# Altium schematic sheet 5V2A Flyback converter Schematic.SchDoc
size A; SheetNumber: 1; SheetTotal: 1; SPICEModelCachePZIJJSTJ: <root> / <DocumentId>PZIJJSTJ</DocumentId> / <CacheFrame Number="0"> / <Model Name="0805_885382207001_1uf" Kind="CKT"> / <Text>******* / .subckt 0805_885382207001_1uF 1 2 / Rser 1 3 0.0237265668732 / Lser 2 4 8.71815019E-10 / C1 3 4 0.000001 / Rpar 3 4 500000000 / .ends 0805_885382207001_1uF</Text> / </Model> / <Model Name="0805_885382207007_100nf" Kind="CKT"> / <Text>******* / .subckt 0805_885382207007_100nF 1 2 / Rser 1 3 0.0397714465846 / Lser 2 4 9.11116414E-10 / C1 3 4 0.0000001 / Rpar 3 4 5000000000 / .ends 0805_885382207007_100nF</Text> / </Model> / <Model Name="1206_885382208006_100nf" Kind="CKT"> / <Text>******* / .subckt 1206_885382208006_100nF 1 2 / Rser 1 3 0.0371158193445 / Lser 2 4 1.097090305E-12 / C1 3 4 0.0000001 / Rpar 3 4 1000000000 / .ends 1206_885382208006_100nF</Text> / </Model> / <Model Name="1206_885382208002_10nf" Kind="CKT"> / <Text>******* / .subckt 1206_885382208002_10nF 1 2 / Rser 1 3 0.131552570055 / Lser 2 4 1.072395374E-09 / C1 3 4 0.00000001 / Rpar 3 4 10000000000 / .ends 1206_885382208002_10nF</Text> / </Model> / <Model Name="0805_885342207005_10nf" Kind="CKT"> / <Text>******* / .subckt 0805_885342207005_10nF 1 2 / Rser 1 3 0.0585018213517 / Lser 2 4 3.64385526E-10 / C1 3 4 0.00000001 / Rpar 3 4 10000000000 / .ends 0805_885342207005_10nF</Text> / </Model> / <Model Name="1812_885342211006_100nf" Kind="CKT"> / <Text>******* / .subckt 1812_885342211006_100nF 1 2 / Rser 1 3 0.0138355219015 / Lser 2 4 8.12989182E-10 / C1 3 4 0.0000001 / Rpar 3 4 1000000000 / .ends 1812_885342211006_100nF</Text> / </Model> / </CacheFrame> / </root>
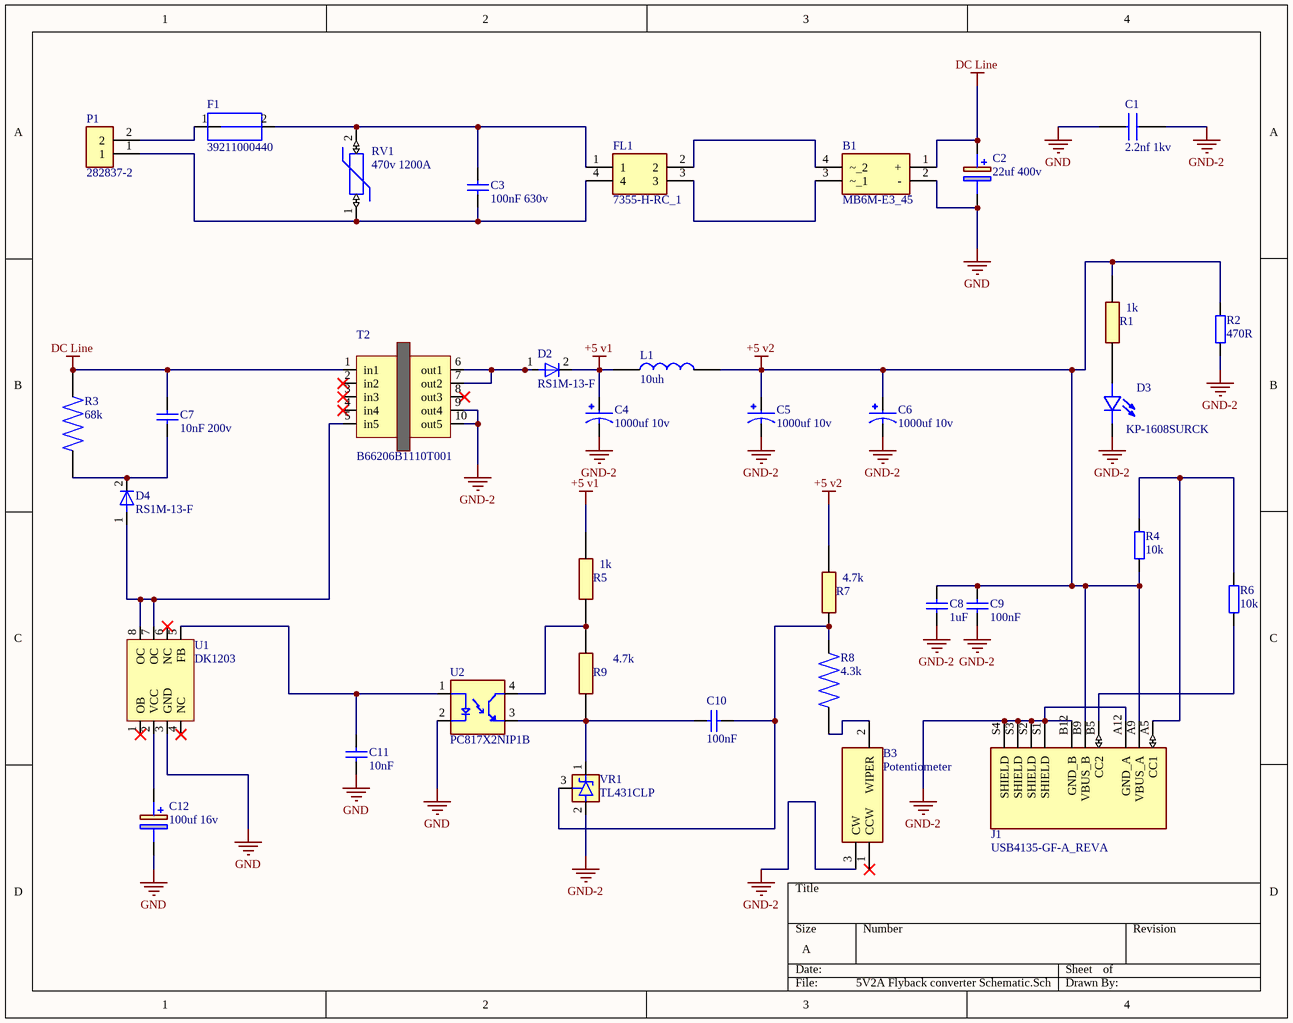
[diagram p0: 5V2A Flyback converter Schematic.SchDoc]

## Parts
B1  MB6M-E3_45  [DIP508W74P254L469H270Q4N]
B3  Potentiometer  [3296Y1504LF]
C1  2.2nf 1kv  [CK45B3AD222KYNNA]
C2  22uf 400v  [CAPPRD500W65D1250H2700]
C3  100nF 630v  [WCAP-CSMH_1812_L4.5W3.2H2]
C4  1000uf 10v  [CAP_EEEFN1A102P]
C5  1000uf 10v  [CAP_EEEFN1A102P]
C6  1000uf 10v  [CAP_EEEFN1A102P]
C7  10nF 200v  [WCAP-CSMH_0805_L2W1.25H1.25]
C8  1uF  [WCAP-CSST_0805_L2W1.25H1.25]
C9  100nF  [WCAP-CSST_0805_L2W1.25H1.25]
C10  100nF  [WCAP-CSST_1206_L3.2W1.6H1.25]
C11  10nF  [WCAP-CSST_1206_L3.2W1.6H1.25]
C12  100uf 16v  [CAPAE1030X1100N]
D2  RS1M-13-F  [B360A-13-F]
D3  KP-1608SURCK  [LED_KP-1608SURCK]
D4  RS1M-13-F  [B360A-13-F]
F1  39211000440  [Littelfuse 39211000440]
FL1  7355-H-RC_1  [7355HRC]
J1  USB4135-GF-A_REVA  [GCT_USB4135-GF-A_REVA]
L1  10uh  [INDPM5552X200N]
P1  282837-2  [TE_282837-2]
R1  1k  [4.7k]
R2  470R  [RES_0402]
R3  68k  [RES_ERA6ARW683V]
R4  10k  [RES_0402]
R5  1k  [4.7k]
R6  10k  [RES_0402]
R7  4.7k  [4.7k]
R8  4.3k  [RES_ERJU03F4301V]
R9  4.7k  [4.7k]
RV1  470v 1200A  [MOV-07DXXXK(3.9T)]
T2  B66206B1110T001  [PCBComponent_1 - duplicate]
U1  DK1203  [DK1203 - duplicate]
U2  PC817X2NIP1B  [SOIC254P960X420-4N]
VR1  TL431CLP  [VREG_TL431CLP]

## Nets
+5 v1: C4.1 D2.2 L1.1 R5.2
+5 v2: C5.1 C6.1 C8.2 C9.2 J1.A9(VBUS_A) J1.B9(VBUS_B) L1.2 R1.2 R2.2 R4.1 R7.2
DC Line: B1.1(+) C2.1(+) C7.2 R3.2 T2.1(in1)
GND: B1.2(-) C1.1 C2.2(-) C11.1 C12.2(-) U1.3(GND) U2.2(C)
GND-2: B3.3(CW) C1.2 C4.2 C5.2 C6.2 C8.1 C9.1 D3.2(C) J1.A12(GND_A) J1.B12(GND_B) J1.S1(SHIELD) J1.S2(SHIELD) J1.S3(SHIELD) J1.S4(SHIELD) R2.1 T2.9(out4) T2.10(out5) VR1.2(ANODE)
NetB1_3: B1.3(~_1) FL1.3
NetB1_4: B1.4(~_2) FL1.2
NetB3_2: B3.2(WIPER) R8.1
NetC3_1: C3.1 FL1.4 P1.1 RV1.1
NetC3_2: C3.2 F1.2 FL1.1 RV1.2
NetC7_1: C7.1 D4.2 R3.1
NetC10_1: C10.1 R9.1 U2.3(ET) VR1.1(CATHODE)
NetC10_2: C10.2 R7.1 R8.2 VR1.3(REF)
NetC11_2: C11.2 U1.5(FB) U2.1(A)
NetC12_1: C12.1(+) U1.2(VCC)
NetD2_1: D2.1 T2.6(out1) T2.7(out2)
NetD3_1: D3.1(A) R1.1
NetD4_1: D4.1 T2.5(in5) U1.7(OC) U1.8(OC)
NetF1_1: F1.1 P1.2
NetJ1_A5: J1.A5(CC1) R4.2 R6.2
NetJ1_B5: J1.B5(CC2) R6.1
NetR5_1: R5.1 R9.2 U2.4(CT)

Not connected (* = marked no-connect by the designer): B3 1(CCW)*; T2 2(in2)* 3(in3)* 4(in4)* 8(out3)*; U1 1(OB)* 4(NC)* 6(NC)*

## Library data of the parts
B1 = MB6M-E3_45: Diode Rectifier Bridge Single 600V 0.8A Vishay MB6M-E3/45, Bridge Rectifier, 0.8A 600V, 4-Pin MBM; Geometry.Height: 2.7mm; Manufacturer_Name: Vishay; Manufacturer_Part_Number: MB6M-E3/45; Mouser Part Number: 625-MB6M-E3; Mouser Price/Stock: https://www.mouser.co.uk/ProductDetail/Vishay-General-Semiconductor/MB6M-E3-45?qs=NyKJzQ80QAzaNJrfLfHWPg%3D%3D; Arrow Part Number: MB6M-E3/45; Arrow Price/Stock: https://www.arrow.com/en/products/mb6m-e345/vishay?region=nac; Datasheet Link: http://www.vishay.com/docs/88660/mb2m.pdf
B3 = Potentiometer: Trimmer Resistors - Through Hole 3/8" 500Kohms Sealed Vertical Adjust; Manufacturer_Name: Bourns; Manufacturer_Part_Number: 3296Y-1-504LF; Geometry.Height: 10.28mm; Mouser Part Number: 652-3296Y-1-504LF; Mouser Price/Stock: https://www.mouser.co.uk/ProductDetail/Bourns/3296Y-1-504LF?qs=YcQ0SKcgwSr8aRG8Of3gNA%3D%3D; Arrow Part Number: 3296Y-1-504LF; Arrow Price/Stock: https://www.arrow.com/en/products/3296y-1-504lf/bourns?region=nac; Datasheet Link: https://componentsearchengine.com/Datasheets/2/3296Y-1-504LF.pdf
C1 = 2.2nf 1kv: Disc Type Capacitors with Lead (High Voltage Ceramic Capacitors), Capacitance=2.2nF, DxT: 8.5x5mm ,F: 5mm; Manufacturer_Name: TDK; Manufacturer_Part_Number: CK45-B3AD222KYNNA; Geometry.Height: 12.5mm; Mouser Part Number: 810-CK45-B3AD222NNA; Mouser Price/Stock: https://www.mouser.co.uk/ProductDetail/TDK/CK45-B3AD222KYNNA?qs=2FIyTMJ0hNk3eTUvPTIP4A%3D%3D; Arrow Part Number: CK45-B3AD222KYNNA; Arrow Price/Stock: https://www.arrow.com/en/products/ck45-b3ad222kynna/tdk?utm_currency=USD&region=nac; Datasheet Link: https://product.tdk.com/system/files/dam/doc/product/capacitor/ceramic/lead-disc/catalog/leaddisc_commercial_ck45_en.pdf
C2 = 22uf: Aluminium Electrolytic Capacitors - Radial Leaded Al Lytic Cap Radial NHG Series 105C; Manufacturer_Name: Panasonic; Manufacturer_Part_Number: ECA-2GHG220; Geometry.Height: 27mm; Mouser Part Number: 667-ECA-2GHG220; Mouser Price/Stock: https://www.mouser.co.uk/ProductDetail/Panasonic/ECA-2GHG220?qs=ScpEy4ykWJx1iqxOLURymA%3D%3D; Arrow Part Number: ECA-2GHG220; Arrow Price/Stock: https://www.arrow.com/en/products/eca-2ghg220/panasonic; Datasheet Link: http://industrial.panasonic.com/cdbs/www-data/pdf/RDF0000/ABA0000C1215.pdf
C3 = 885342211006: WCAP-CSMH Multilayer Ceramic Chip Capacitor, Mid and High Voltage, size 1812, X7R Class II, 100nF, 630VDC; Manufacturer: Wurth Elektronik; Case/Size Code: 1812; Capacitance Tolerance: 10%; Dissipation Factor: 2.5%; Insulation Resistance: 1GΩ; Technical Reference: X7R1812104K630DFCT10000; Manufacturer Part Number: 885342211006; Category: Multilayer Ceramic Chip Capacitors; Match Code: WCAP-CSMH; ComponentLink1Description: Website Link; ComponentLink1URL: https://www.we-online.com/redexpert/article/885342211006?ad; ComponentLink2Description: Datasheet Link; ComponentLink2URL: https://www.we-online.com/redexpert/spec/885342211006?ad; Mount: Surface Mount; Operating Temperature Max: 125°C; Operating Temperature Min: -55°C; Packaging: Tape and Reel; Length: 4.5mm; Width: 3.2mm; Height: 2mm; Capacitance: 100nF; Ceramic Type: X7R Class II; Rated Voltage (DC): 630V
C4-C6 = EEEFN1A102P: CAP ALUM 1000UF 20% 10V SMD; MP: EEE-FN1A102P; MF: Panasonic Electronic Components; Package: RADIAL-2 Panasonic; Availability: In Stock; Price: None; Check_prices: https://www.snapeda.com/parts/EEE-FN1A102P/Panasonic/view-part/6178528/?ref=eda; Purchase-URL: https://pricing.snapeda.com/search/part/EEE-FN1A102P/?ref=eda; Value: *; SnapEDA_Link: https://www.snapeda.com/parts/EEE-FN1A102P/Panasonic/view-part/6178528/?ref=snap
C7 = 885342207005: WCAP-CSMH Multilayer Ceramic Chip Capacitor, Mid and High Voltage, size 0805, X7R Class II, 10nF, 200VDC; Manufacturer: Wurth Elektronik; Case/Size Code: 0805; Capacitance Tolerance: 10%; Dissipation Factor: 2.5%; Insulation Resistance: 10GΩ; Technical Reference: X7R0805103K200DFCT10000; Manufacturer Part Number: 885342207005; Category: Multilayer Ceramic Chip Capacitors; Match Code: WCAP-CSMH; ComponentLink1Description: Website Link; ComponentLink1URL: https://www.we-online.com/redexpert/article/885342207005?ad; ComponentLink2Description: Datasheet Link; ComponentLink2URL: https://www.we-online.com/redexpert/spec/885342207005?ad; Mount: Surface Mount; Operating Temperature Max: 125°C; Operating Temperature Min: -55°C; Packaging: Tape and Reel; Length: 2mm; Width: 1.25mm; Height: 1.25mm; Capacitance: 10nF; Ceramic Type: X7R Class II; Rated Voltage (DC): 200V
C8 = 885382207001: WCAP-CSST Multilayer Ceramic Chip Capacitor, Soft Termination, SMT, size 0805, X7R Class II, 1uF, 16V; Manufacturer: Wurth Elektronik; Case/Size Code: 0805; Capacitance Tolerance: +/-10%; Dissipation Factor: 5%; Insulation Resistance: 0.5GOhm; Technical Reference: X7R0805105K016DFCT1S000; Manufacturer Part Number: 885382207001; Category: Multilayer Ceramic Chip Capacitors; Match Code: WCAP-CSST; ComponentLink1Description: Website Link; ComponentLink1URL: https://www.we-online.com/redexpert/article/885382207001?ad; ComponentLink2Description: Datasheet Link; ComponentLink2URL: https://www.we-online.com/redexpert/spec/885382207001?ad; Mount: Surface Mount; Operating Temperature Max: 125°C; Operating Temperature Min: -55°C; Packaging: Tape and Reel; Length: 2mm; Width: 1.25mm; Height: 1.25mm; Capacitance: 1uF; Ceramic Type: X7R Class II; Rated Voltage (DC): 16V
C9 = 885382207007: WCAP-CSST Multilayer Ceramic Chip Capacitor, Soft Termination, SMT, size 0805, X7R Class II, 100nF, 50V; Manufacturer: Wurth Elektronik; Case/Size Code: 0805; Capacitance Tolerance: +/-10%; Dissipation Factor: 2.5%; Insulation Resistance: 5GOhm; Technical Reference: X7R0805104K050DFCT1S000; Manufacturer Part Number: 885382207007; Category: Multilayer Ceramic Chip Capacitors; Match Code: WCAP-CSST; ComponentLink1Description: Website Link; ComponentLink1URL: https://www.we-online.com/redexpert/article/885382207007?ad; ComponentLink2Description: Datasheet Link; ComponentLink2URL: https://www.we-online.com/redexpert/spec/885382207007?ad; Mount: Surface Mount; Operating Temperature Max: 125°C; Operating Temperature Min: -55°C; Packaging: Tape and Reel; Length: 2mm; Width: 1.25mm; Height: 1.25mm; Capacitance: 100nF; Ceramic Type: X7R Class II; Rated Voltage (DC): 50V
C10 = 885382208006: WCAP-CSST Multilayer Ceramic Chip Capacitor, Soft Termination, SMT, size 1206, X7R Class II, 100nF, 100V; Manufacturer: Wurth Elektronik; Case/Size Code: 1206; Capacitance Tolerance: +/-10%; Dissipation Factor: 2.5%; Insulation Resistance: 1GOhm; Technical Reference: X7R1206104K100DFCT1S000; Manufacturer Part Number: 885382208006; Category: Multilayer Ceramic Chip Capacitors; Match Code: WCAP-CSST; ComponentLink1Description: Website Link; ComponentLink1URL: https://www.we-online.com/redexpert/article/885382208006?ad; ComponentLink2Description: Datasheet Link; ComponentLink2URL: https://www.we-online.com/redexpert/spec/885382208006?ad; Mount: Surface Mount; Operating Temperature Max: 125°C; Operating Temperature Min: -55°C; Packaging: Tape and Reel; Length: 3.2mm; Width: 1.6mm; Height: 1.25mm; Capacitance: 100nF; Ceramic Type: X7R Class II; Rated Voltage (DC): 100V
C11 = 885382208002: WCAP-CSST Multilayer Ceramic Chip Capacitor, Soft Termination, SMT, size 1206, X7R Class II, 10nF, 50V; Manufacturer: Wurth Elektronik; Case/Size Code: 1206; Capacitance Tolerance: +/-10%; Dissipation Factor: 2.5%; Insulation Resistance: 10GOhm; Technical Reference: X7R1206103K050DFCT1S000; Manufacturer Part Number: 885382208002; Category: Multilayer Ceramic Chip Capacitors; Match Code: WCAP-CSST; ComponentLink1Description: Website Link; ComponentLink1URL: https://www.we-online.com/redexpert/article/885382208002?ad; ComponentLink2Description: Datasheet Link; ComponentLink2URL: https://www.we-online.com/redexpert/spec/885382208002?ad; Mount: Surface Mount; Operating Temperature Max: 125°C; Operating Temperature Min: -55°C; Packaging: Tape and Reel; Length: 3.2mm; Width: 1.6mm; Height: 1.25mm; Capacitance: 10nF; Ceramic Type: X7R Class II; Rated Voltage (DC): 50V
C12 = 100uf16v: Nichicon 100uF 16 V dc Polymer Aluminium Electrolytic Capacitor, PS Series 2000h 10 Dia. x 7.7mm; Manufacturer_Part_Number: RPS1C101MCN1GS; Geometry.Height: 11mm; Manufacturer_Name: Nichicon; Mouser Part Number: 647-RPS1C101MCN1GS; Mouser Price/Stock: https://www.mouser.co.uk/ProductDetail/Nichicon/RPS1C101MCN1GS?qs=eL6fcoQH66MLvHfa%252BDZQ0A%3D%3D; Arrow Part Number: RPS1C101MCN1GS; Arrow Price/Stock: https://www.arrow.com/en/products/rps1c101mcn1gs/nichicon?region=nac; Datasheet Link: https://www.arrow.com/en/products/rps1c101mcn1gs/nichicon?region=nac
D2 D4 = RS1M-13-F: Rectifier Diode Switching 1KV 1A 500ns 2-Pin SMA T/R / DIODE GEN PURP 1KV 1A SMA; Manufacturer: Diodes; Max Reverse Current: 5uA; Max Surge Current: 30A; Forward Voltage: 1.3V; Polarity: Standard; Value: 15pF; Supplier: Future Electronics; Supplier Part Number: 9545039; Manufacturer Part Number: RS1M-13-F; RoHS: Yes; Category: Rectifier Diodes; Stock: 400000; Pricing: 5000=0.0396, 10000=0.0389, 15000=0.0385, 20000=0.0383, 25000=0.0374 (USD); Mounting Technology: Surface Mount; Case/Package: SMA; Pins: 2; Weight: 0.002258oz; Min Operating Temperature: -65°C; Max Operating Temperature: 150°C; Packaging: Tape and Reel; Forward Current: 1A; Package Quantity: 5000; Recovery Time: 500ns; Reverse Voltage (DC): 1kV; Average Rectified Current: 1A; Reverse Recovery Time: 500ns; Max Repetitive Reverse Voltage (Vrrm): 1kV; Peak Non-Repetitive Surge Current: 30A; Max Forward Surge Current (Ifsm): 30A; Voltage Rating (DC): 1kV; Current Rating: 1A; Output Current: 1A; Current: 1A; Voltage: 1kV; Max Reverse Voltage (DC): 1kV; Series: -; Reverse Recovery Time-Max: 500ns; Reverse Voltage: 1kV; Length: 4.6mm; Width: 2.92mm; Height: 2.1mm; Radiation Hardening: No; Reach SVHC Compliant: No; Lead Free: Lead Free; RoHS Compliant: Yes; ComponentLink1URL: https://datasheet.ciiva.com/22695/1911854-22695829.pdf?src-supplier=Element14; ComponentLink1Description: https://datasheet.ciiva.com/22695/1911854-22695829.pdf?src-supplier=Element14; ComponentLink2URL: https://datasheet.ciiva.com/8301/ds15002-8301719.pdf?src-supplier=Avnet; ComponentLink2Description: https://datasheet.ciiva.com/8301/ds15002-8301719.pdf?src-supplier=Avnet; ComponentLink3URL: https://datasheet.ciiva.com/15144/getdatasheetpartid-102368-15144828.pdf?src-supplier=Verical; ComponentLink3Description: https://datasheet.ciiva.com/15144/getdatasheetpartid-102368-15144828.pdf?src-supplier=Verical
D3 = KP-1608SURCK: LED; SMD; 0603; red; 50-150mcd; 1.6x0.8mm; 120Â°; 20mA;; MF: Kingbright; SnapEDA_Link: https://www.snapeda.com/parts/KP-1608SURCK/Kingbright/view-part/?ref=snap; Package: 0603 Kingbright; Value: *; MP: KP-1608SURCK; Check_prices: https://www.snapeda.com/parts/KP-1608SURCK/Kingbright/view-part/?ref=eda
F1 = 39211000440: Fuse Subminiature Slow Blow Acting 1.1A 250V Radial 8.5 X 4 X 8mm Thermoplastic Bulk; Manufacturer: Littelfuse Wickmann; Supplier: Digikey; Supplier Part Number: F4534-ND; Manufacturer Part Number: 39211000440; RoHS: Yes; Category: Fuses; Stock: 1396; Pricing: 1=0.43, 5=0.36, 10=0.331, 50=0.2748, 100=0.2535, 250=0.22792, 500=0.21026, 1400=0.18639, 5600=0.15824 (USD); ComponentLink1URL: https://datasheet.ciiva.com/7463/ltitelfuse-fuse-392-7463242.pdf?src-supplier=Digikey; ComponentLink1Description: https://datasheet.ciiva.com/7463/ltitelfuse-fuse-392-7463242.pdf?src-supplier=Digikey; ComponentLink2URL: https://datasheet.ciiva.com/8078/ltitelfuse-fuse-392-8078439.pdf?src-supplier=Element14; ComponentLink2Description: https://datasheet.ciiva.com/8078/ltitelfuse-fuse-392-8078439.pdf?src-supplier=Element14; ComponentLink3URL: https://datasheet.ciiva.com/4483/ltitelfuse-fuse-392-42681-4483166.pdf?src-supplier=Mouser; ComponentLink3Description: https://datasheet.ciiva.com/4483/ltitelfuse-fuse-392-42681-4483166.pdf?src-supplier=Mouser
FL1 = 7355-H-RC_1: Filter; Manufacturer_Name: Bourns; Datasheet Link: https://www.bourns.com/docs/Product-Datasheets/7300_series.pdf; Height: 12mm; Manufacturer_Part_Number: 7355-H-RC
J1 = USB4135-GF-A_REVA: USB CONN, TYPE C, R/A RCPT, 6POS, SMT; USB Connector Type:USB Type C; USB Standard:-; Gender:Receptacle; No. of Positions:6Positions; Connector Mounting:Surface Mount; Orientation:Right Angle; Contact 26AK7776; MF: Global Connector Technology; MP: USB4135GFA; SnapEDA_Link: https://www.snapeda.com/parts/USB4135GFA/Global+Connector+Technology/view-part/?ref=snap; Package: None; Value: *; Check_prices: https://www.snapeda.com/parts/USB4135GFA/Global+Connector+Technology/view-part/?ref=eda
L1 = 10uh: Vishay IHLP2020BZ-01 Series Shielded Wire-wound SMD Inductor 10 uH +/-20% 4A Idc; Manufacturer_Part_Number: IHLP2020BZER100M01; Geometry.Height: 2mm; Manufacturer_Name: Vishay; Mouser Part Number: 70-IHLP2020BZER100M0; Mouser Price/Stock: https://www.mouser.co.uk/ProductDetail/Vishay-Dale/IHLP2020BZER100M01?qs=ZAjGDd5n2aH5Lxf04Dpbtg%3D%3D; Arrow Part Number: IHLP2020BZER100M01; Arrow Price/Stock: https://www.arrow.com/en/products/ihlp2020bzer100m01/vishay?region=europe; Datasheet Link: https://datasheet.datasheetarchive.com/originals/distributors/Datasheets-DGA11/2193762.pdf
P1 = 282837-2: Ð Ð°Ð·ÑŠÐµÐ¼Ð½Ñ‹Ðµ ÐºÐ»ÐµÐ¼Ð¼Ð½Ñ‹Ðµ ÐºÐ¾Ð»Ð¾Ð´ÐºÐ¸ Ð Ð¾Ð·ÐµÑ‚ÐºÐ° 2 Ð¿Ð¾Ð»Ð¾Ð¶ÐµÐ½Ð¸Ñ 5,08 Ð¼Ð¼ ÐŸÑ€Ð¸Ð¿Ð¾Ð¹ Ð¿Ñ€ÑÐ¼Ð¾Ð¹ Ñ‡ÐµÑ€ÐµÐ· Ð¾Ñ‚Ð²ÐµÑ€ÑÑ‚Ð¸Ðµ 13,5 Ð / ÐºÐ¾Ð½Ñ‚Ð°ÐºÑ‚; MF: TE Connectivity; SnapEDA_Link: https://www.snapeda.com/parts/282837-2/TE+Connectivity+AMP+Connectors/view-part/?ref=snap; Price: None; Check_prices: https://www.snapeda.com/parts/282837-2/TE+Connectivity+AMP+Connectors/view-part/?ref=eda; Purchase-URL: https://pricing.snapeda.com/search/part/282837-2/?ref=eda; MP: 282837-2; Value: *; Availability: In Stock; Package: None
R1 R5 R7 R9 = 4.7k: CRCW1206 Resistor T/R 0.25W,1%,4K7 Vishay CRCW Series Thick Film Surface Mount Resistor 1206 Case 4.7k; Manufacturer_Part_Number: CRCW12064K70FKEA; Geometry.Height: 0.6mm; Manufacturer_Name: Vishay; Mouser Part Number: 71-CRCW1206-4.7K-E3; Mouser Price/Stock: https://www.mouser.co.uk/ProductDetail/Vishay-Dale/CRCW12064K70FKEA?qs=1vm4qhDHCvlKJmatsKzyFQ%3D%3D; Arrow Part Number: CRCW12064K70FKEA; Arrow Price/Stock: https://www.arrow.com/en/products/crcw12064k70fkea/vishay; Datasheet Link: https://datasheet.datasheetarchive.com/originals/distributors/DKDS-23/452928.pdf
R2 R4 R6 = RES_0402: Resistor SMD 0402; Manufacturer: *; Manufacturer Part Number: *; Distributor Link: *; LCSC: *
R3 = ERA6ARW683V: RES 68K OHM 0.05% 1/8W 0805; MF: Panasonic; SnapEDA_Link: https://www.snapeda.com/parts/ERA6ARW683V/Panasonic/view-part/?ref=snap; Package: 2012-2 Panasonic; Value: *; MP: ERA6ARW683V; Check_prices: https://www.snapeda.com/parts/ERA6ARW683V/Panasonic/view-part/?ref=eda
R8 = ERJU03F4301V: RES 4.3K OHM 1% 1/10W 0603 SMD; MF: Panasonic; MP: ERJ-U03F4301V; SnapEDA_Link: https://www.snapeda.com/parts/ERJ-U03F4301V/Panasonic/view-part/?ref=snap; Package: 1608-2 Panasonic; Value: *; Check_prices: https://www.snapeda.com/parts/ERJ-U03F4301V/Panasonic/view-part/?ref=eda
RV1 = MOV-07D470K: 47 V 250 A Varistor 1 Circuit Through Hole Disc 7mm; MF: Bourns; Package: Disc-7 Bourns; Purchase-URL: https://pricing.snapeda.com/search/part/MOV-07D470K/?ref=eda; MP: MOV-07D470K; Value: *; Availability: In Stock; SnapEDA_Link: https://www.snapeda.com/parts/MOV-07D470K/Bourns/view-part/?ref=snap; Price: None; Check_prices: https://www.snapeda.com/parts/MOV-07D470K/Bourns/view-part/?ref=eda
T2 = B66206B1110T001: Ferrite Accessories, Planar Cores Accessories(E/ELP), Coil former (E 20/10/6); Manufacturer: TDK EPCOS; Lead Diameter: 450um; Supplier: Digikey; Supplier Part Number: 495-5365-ND; Manufacturer Part Number: B66206B1110T001; RoHS: Yes; Category: EMI / RFI Components; Stock: 1221; Pricing: 1=1.95, 10=1.341, 25=1.1464, 50=1.0128, 100=0.8897, 250=0.78212 (USD); Packaging: 14Packaging; Termination: 4753ConnectorType; Lead Pitch: 3.81mm; ComponentLink1URL: https://datasheet.ciiva.com/1375/1756165-1375209.pdf?src-supplier=Element14; ComponentLink1Description: https://datasheet.ciiva.com/1375/1756165-1375209.pdf?src-supplier=Element14; ComponentLink2URL: https://datasheet.ciiva.com/18504/e-20-10-6-18504329.pdf?src-supplier=Digikey; ComponentLink2Description: https://datasheet.ciiva.com/18504/e-20-10-6-18504329.pdf?src-supplier=Digikey
U1 = DK1203: Manufacturer: ON Semiconductor; Manufacturer Part Number: NCP1203GEVB; Switching Frequency: 60kHz; Output Voltage: 19V; Output Current: 4A; Evaluation Kit: Yes; Supplier: Newark; Supplier Part Number: 73R4611; RoHS: Yes; Category: Embedded Processors and Controllers; Package Quantity: 1; ComponentLink1URL: https://datasheet.ciiva.com/2395/ncp1200-d-2395097.pdf?src-supplier=Digikey; ComponentLink1Description: https://datasheet.ciiva.com/2395/ncp1200-d-2395097.pdf?src-supplier=Digikey
U2 = PC817X2NIP1B: Optocoupler DC-IN 1-CH Transistor DC-OUT 4-Pin DIP SMD T/R; MF: Sharp Microelectronics; SnapEDA_Link: https://www.snapeda.com/parts/PC817X2NIP1B/Sharp+Microelectronics/view-part/?ref=snap; Package: SMD-4 Sharp Microelectronics; Value: *; MP: PC817X2NIP1B; Check_prices: https://www.snapeda.com/parts/PC817X2NIP1B/Sharp+Microelectronics/view-part/?ref=eda
VR1 = TL431CLP: Adjustable precision shunt regulator; MF: Texas Instruments; SnapEDA_Link: https://www.snapeda.com/parts/TL431CLP/Texas+Instruments/view-part/?ref=snap; Package: TO-92 Texas Instruments; Value: *; MP: TL431CLP; Check_prices: https://www.snapeda.com/parts/TL431CLP/Texas+Instruments/view-part/?ref=eda